# Altium schematic sheet DC Motor_SCH.SchDoc
size A4; SheetNumber: 1; SheetTotal: 1
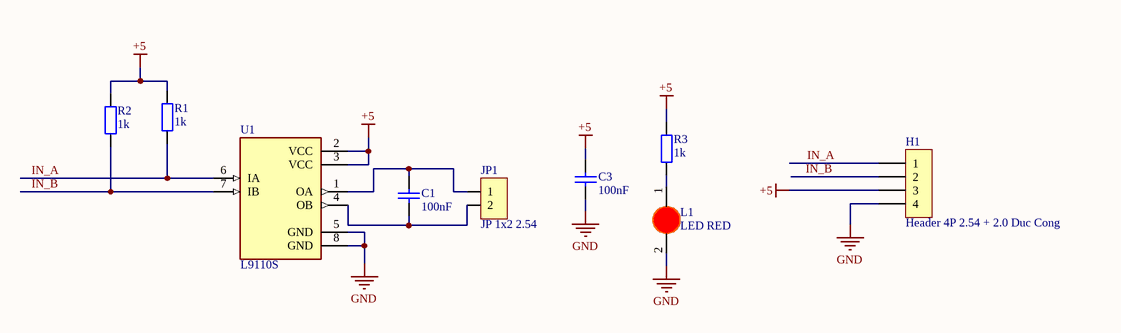
[diagram p0: DC Motor_SCH.SchDoc]

## Parts
C1  100nF  [tu 0603]
C3  100nF  [tu 0603]
H1  Header 4P 2.54 + 2.0 Duc Cong  [Header 4P DC 2.54 + 2.0]
JP1  JP 1x2 2.54  [JP 1x2 DT]
L1  LED RED  [LED-0805-Red]
R1  1k  [tro smd 0603]
R2  1k  [tro smd 0603]
R3  1k  [tro smd 0603]
U1  L9110S  [SOIC127P599X172-8N]

## Nets
+5: C3.1 H1.3 R1.2 R2.2 R3.2 U1.2(VCC) U1.3(VCC)
GND: C3.2 H1.4 L1.2(K) U1.5(GND) U1.8(GND)
IN_A: H1.1 R1.1 U1.6(IA)
IN_B: H1.2 R2.1 U1.7(IB)
NetC1_1: C1.1 JP1.1 U1.1(OA)
NetC1_2: C1.2 JP1.2 U1.4(OB)
NetL1_1: L1.1(A) R3.1

## Library data of the parts
C1 C3 = Tu 0603 104 50V 10%: Dán; Don_Vi: Con; So_Chan: 2; Ten_Linh_Kien: Tụ 0603 104-100nF 10% 50V; Ma_Hang: MH004568; Chung_Loai: Dán; Kieu_Chan: *
H1 = Header 4P 2.54 + 2.0 Duc Cong: Cắm; Ten_Linh_Kien: Header 4P XH2.54-4P Đực Cong; Don_Vi: Con; Ma_Hang: MH001310; Chung_Loai: Cắm
JP1 = JP 1x2 2.54 Duc Thang: Cắm; Ten_Linh_Kien: Jump Đơn Đực 2.54MM 1x40P Thẳng 11MM; Don_Vi: Con; Ma_Hang: MH000903; Ghi_Chu: *; Kieu_Chan: *; Chung_Loai: Cắm
L1 = LED 0805 Do: Dán; Don_Vi: Con; Ma_Hang: MH000897; Ten_Linh_Kien: LED 0805 Màu Đỏ (Red); Ghi_Chu: *; Kieu_Chan: *; Chung_Loai: Dán
R1-R3 = Tro 0603 1% 1k: Dán; So_Chan: 2; Don_Vi: Con; Ten_Linh_Kien: Trở 0603 1% 1k; Ma_Hang: MH006334; Chung_Loai: Dán; Kieu_Chan: *
U1 = L9110S: SOP-8 MOTOR DRIVER ICS ROHS; MF: ON Semiconductor; SnapEDA_Link: https://www.snapeda.com/parts/L9110S/Onsemi/view-part/?ref=snap; Package: None; Value: *; MP: L9110S; Check_prices: https://www.snapeda.com/parts/L9110S/Onsemi/view-part/?ref=eda